# Altium schematic sheet 03_MCU.SchDoc
size A4; SheetNumber: 3; SheetTotal: 5
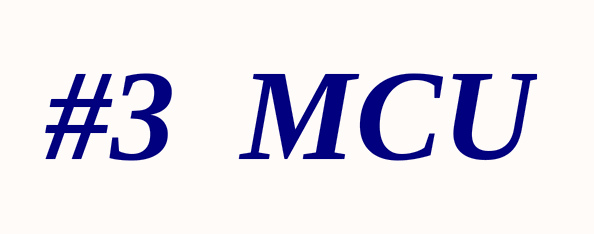
[diagram p0: 03_MCU.SchDoc]

## Notes on the sheet
- #3  MCU